# EAGLE schematic VDC (EAGLE 6.0)
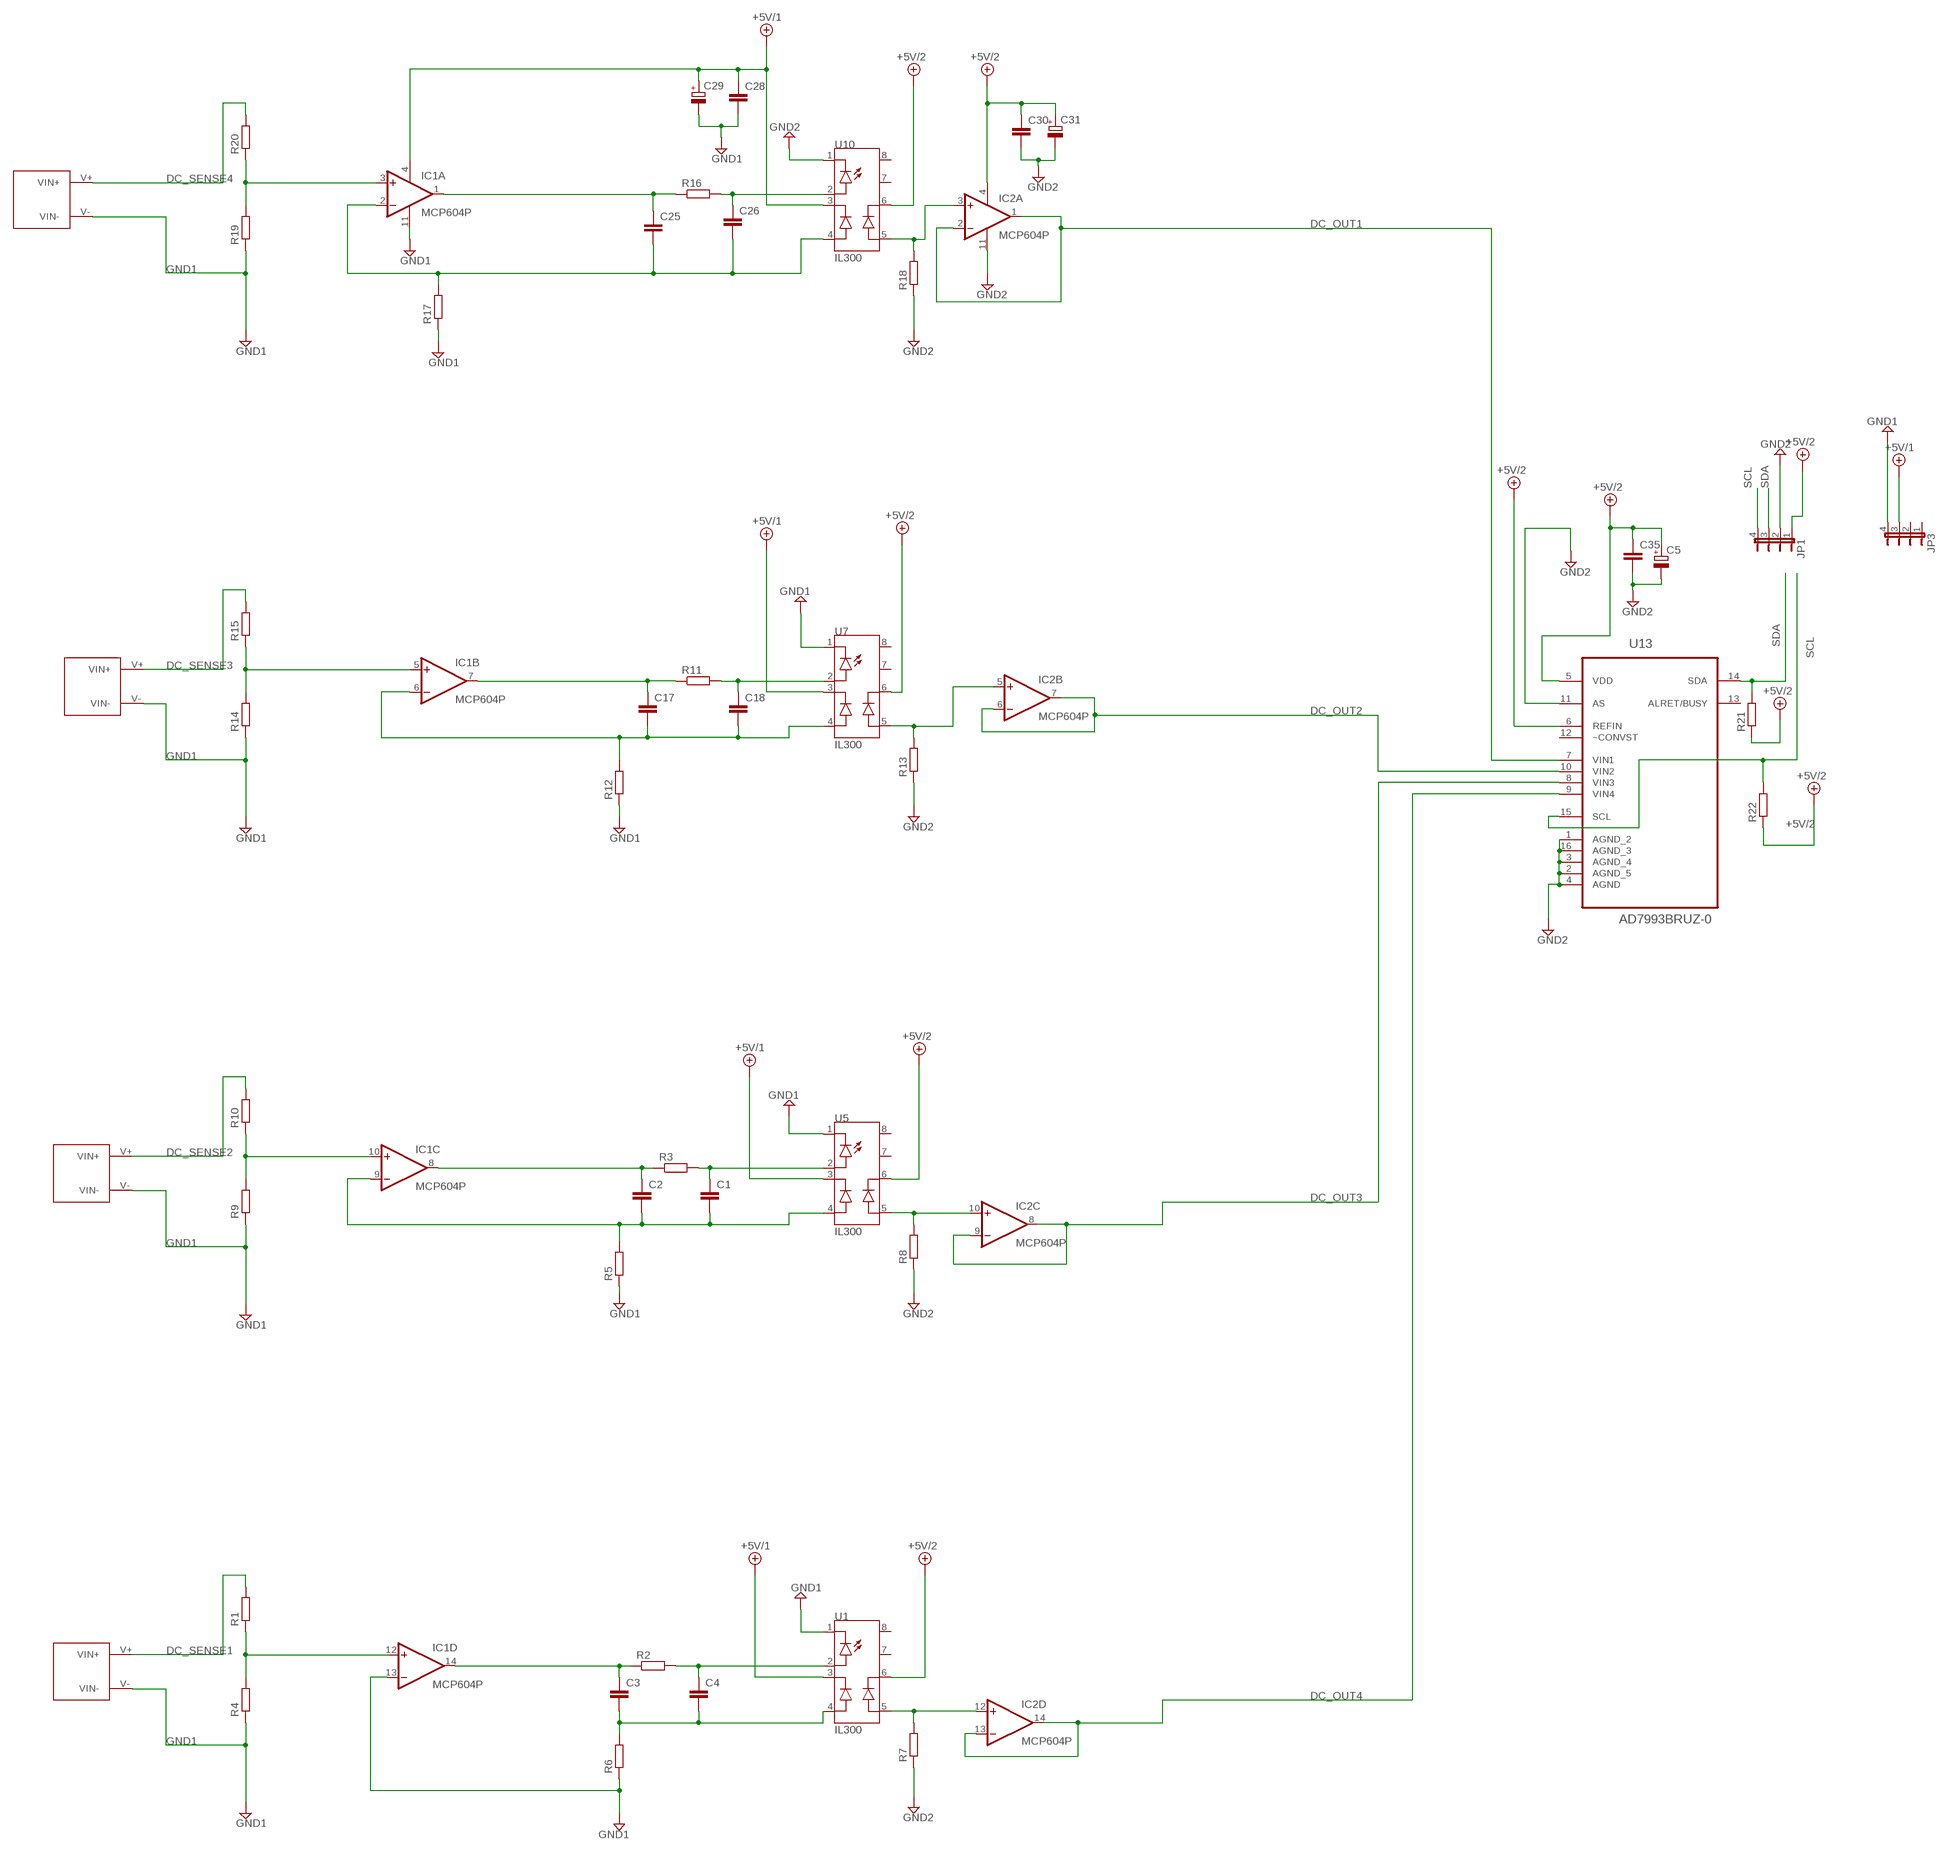
[diagram p0: schematic, sheet 1]

## Parts
C1  C-EU025-040X050  [C025-040X050]
C2  C-EU025-040X050  [C025-040X050]
C3  C-EU025-040X050  [C025-040X050]
C4  C-EU025-040X050  [C025-040X050]
C5  CPOL-EUE2-4  [E2-4]
C17  C-EU025-040X050  [C025-040X050]
C18  C-EU025-040X050  [C025-040X050]
C25  C-EU025-040X050  [C025-040X050]
C26  C-EU025-040X050  [C025-040X050]
C28  C-EU025-040X050  [C025-040X050]
C29  CPOL-EUE2-5  [E2-5]
C30  C-EU025-040X050  [C025-040X050]
C31  CPOL-EUE2-5  [E2-5]
C35  C-EU025-025X050  [C025-025X050]
IC1  MCP604P  [DIL14]
IC2  MCP604P  [DIL14]
JP1  JP4E  [JP4]
JP3  JP4E  [JP4]
R1  R-EU_0207/10  [0207/10]
R2  R-EU_0207/10  [0207/10]
R3  R-EU_0207/10  [0207/10]
R4  R-EU_0207/10  [0207/10]
R5  R-EU_0207/10  [0207/10]
R6  R-EU_0207/10  [0207/10]
R7  R-EU_0207/10  [0207/10]
R8  R-EU_0207/10  [0207/10]
R9  R-EU_0207/10  [0207/10]
R10  R-EU_0207/10  [0207/10]
R11  R-EU_0207/10  [0207/10]
R12  R-EU_0207/10  [0207/10]
R13  R-EU_0207/10  [0207/10]
R14  R-EU_0207/10  [0207/10]
R15  R-EU_0207/10  [0207/10]
R16  R-EU_0207/10  [0207/10]
R17  R-EU_0207/10  [0207/10]
R18  R-EU_0207/10  [0207/10]
R19  R-EU_0207/10  [0207/10]
R20  R-EU_0207/10  [0207/10]
R21  R-EU_0207/10  [0207/10]
R22  R-EU_0207/10  [0207/10]
U1  IL300  [DIL08]
U5  IL300  [DIL08]
U7  IL300  [DIL08]
U10  IL300  [DIL08]
U13  AD7993BRUZ-0  [SOP65P640X120-16N]
U$5  INPUT_VOLTAGE_CONNECTOR  [INPUT_VOLTAGE_CONNECTOR]
U$6  INPUT_VOLTAGE_CONNECTOR  [INPUT_VOLTAGE_CONNECTOR]
U$7  INPUT_VOLTAGE_CONNECTOR  [INPUT_VOLTAGE_CONNECTOR]
U$8  INPUT_VOLTAGE_CONNECTOR  [INPUT_VOLTAGE_CONNECTOR]

## Nets
+5V/1: C28.1 C29.+ IC1.4(P:V+) JP3.3 U1.3(C_FB) U5.3(C_FB) U7.3(C_FB) U10.3(C_FB)
+5V/2: C5.+ C30.1 C31.+ C35.1 IC2.4(P:V+) JP1.1 R21.1 R22.1 U1.6(C_OUT) U5.6(C_OUT) U7.6(C_OUT) U10.6(C_OUT) U13.5(VDD) U13.6(REFIN)
DC_OUT1: IC2.1(A:OUT) IC2.2(A:-IN) U13.7(VIN1)
DC_OUT2: IC2.6(B:-IN) IC2.7(B:OUT) U13.10(VIN2)
DC_OUT3: IC2.8(C:OUT) IC2.9(C:-IN) U13.8(VIN3)
DC_OUT4: IC2.13(D:-IN) IC2.14(D:OUT) U13.9(VIN4)
DC_SENSE1: R1.2 U$8.V+(VIN+)
DC_SENSE2: R10.2 U$7.V+(VIN+)
DC_SENSE3: R15.2 U$6.V+(VIN+)
DC_SENSE4: R20.2 U$5.V+(VIN+)
GND1: C28.2 C29.- IC1.11(P:V-) IC1.13(D:-IN) JP3.4 R4.1 R5.1 R6.1 R9.1 R12.1 R14.1 R17.1 R19.1 U1.1(C_LED) U5.1(C_LED) U7.1(C_LED) U$5.V-(VIN-) U$6.V-(VIN-) U$7.V-(VIN-) U$8.V-(VIN-)
GND2: C5.- C30.2 C31.- C35.2 IC2.11(P:V-) JP1.2 R7.1 R8.1 R13.1 R18.1 U10.1(C_LED) U13.1(AGND_2) U13.2(AGND_5) U13.3(AGND_4) U13.4(AGND) U13.11(AS) U13.16(AGND_3)
N$1: C3.2 C4.2 R6.2 U1.4(A_FB)
N$2: C1.2 C2.2 IC1.9(C:-IN) R5.2 U5.4(A_FB)
N$3: IC2.12(D:+IN) R7.2 U1.5(A_OUT)
N$4: C4.1 R2.2 U1.2(A_LED)
N$5: C3.1 IC1.14(D:OUT) R2.1
N$6: C1.1 R3.2 U5.2(A_LED)
N$7: C2.1 IC1.8(C:OUT) R3.1
N$8: IC1.12(D:+IN) R1.1 R4.2
N$9: IC2.10(C:+IN) R8.2 U5.5(A_OUT)
N$10: IC1.10(C:+IN) R9.2 R10.1
N$12: C18.1 R11.2 U7.2(A_LED)
N$13: C17.1 IC1.7(B:OUT) R11.1
N$14: IC2.5(B:+IN) R13.2 U7.5(A_OUT)
N$15: IC1.5(B:+IN) R14.2 R15.1
N$16: C25.2 C26.2 IC1.2(A:-IN) R17.2 U10.4(A_FB)
N$17: C26.1 R16.2 U10.2(A_LED)
N$18: C25.1 IC1.1(A:OUT) R16.1
N$19: IC2.3(A:+IN) R18.2 U10.5(A_OUT)
N$20: IC1.3(A:+IN) R19.2 R20.1
N$23: C17.2 C18.2 IC1.6(B:-IN) R12.2 U7.4(A_FB)
SCL: JP1.4 R22.2 U13.15(SCL)
SDA: JP1.3 R21.2 U13.14(SDA)
Unconnected: JP3.1 JP3.2 U1.7(PIN7) U1.8(PIN8) U5.7(PIN7) U5.8(PIN8) U7.7(PIN7) U7.8(PIN8) U10.7(PIN7) U10.8(PIN8) U13.12(~CONVST) U13.13(ALRET/BUSY)

## Library data of the parts
C1-C4 C17 C18 C25 C26 C28 C30 C35 = resistor:C-EU: CAPACITOR, European symbol
C5 C29 C31 = resistor:CPOL-EU: POLARIZED CAPACITOR, European symbol
IC1 IC2 = linear - Power:MCP604: Quad Op Amp 2.7V to 6.0V Single Supply CMOS Source: http://ww1.microchip.com/downloads/en/DeviceDoc/21314g.pdf
JP1 JP3 = jumper:JP4E: JUMPER
R1-R22 = resistor:R-EU_: RESISTOR, European symbol
U1 U5 U7 U10 = ic-optoisolator:IL300
U13 = ADC:AD7993BRUZ-0: ADC; MPN: AD7993BRUZ-0; OC_FARNELL: 1078309; OC_NEWARK: 59K6101; PACKAGE: TSSOP-16; SUPPLIER: Analog Devices
U$5-U$8 = ekohub2013:INPUT_VOLTAGE_CONNECTOR